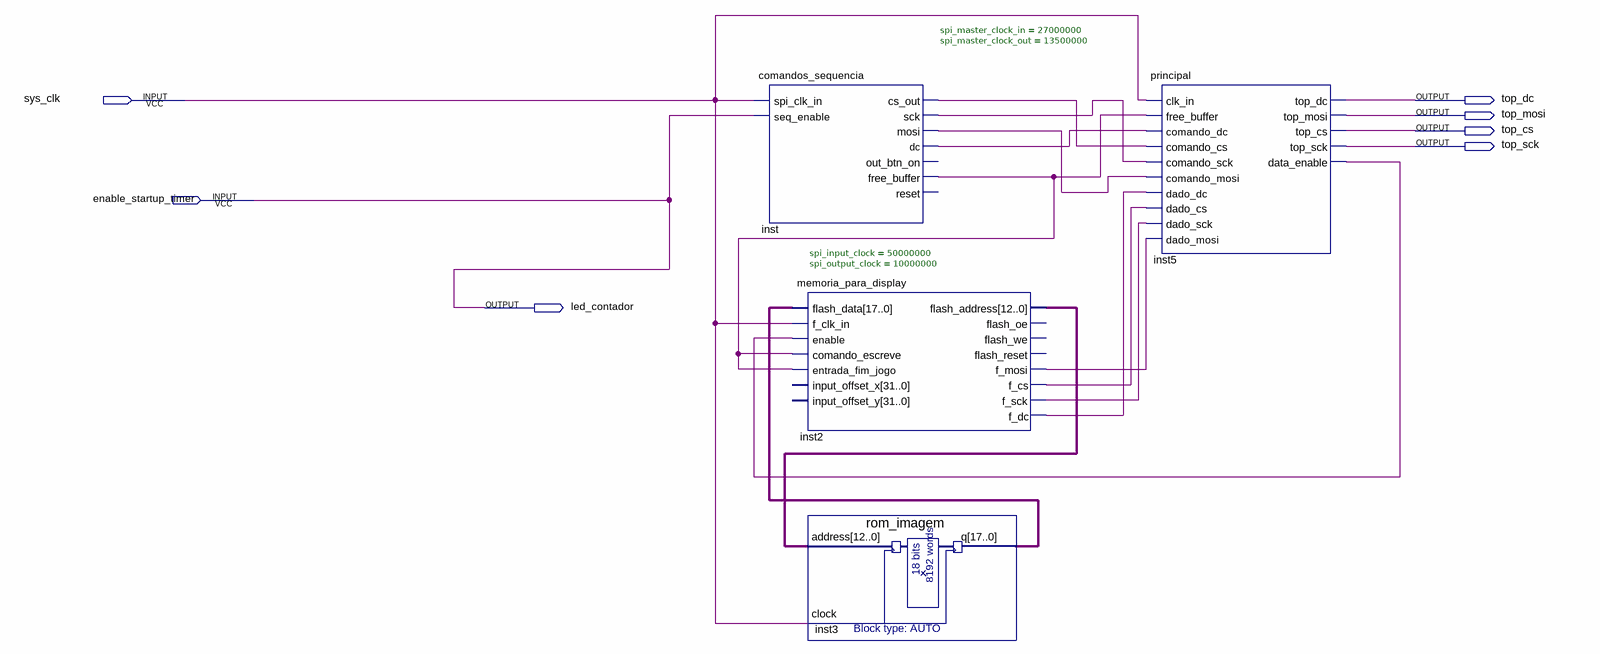
[diagram p0: schematic sheet]
// Quartus schematic top.bdf as structural Verilog: 4 symbols, 7 pins
module top (
  input  sys_clk,
  input  enable_startup_timer,
  output top_dc,
  output top_mosi,
  output top_cs,
  output top_sck,
  output led_contador
);

  wire inst2_f_cs, inst2_f_dc, inst2_f_mosi, inst2_f_sck, inst5_data_enable, inst_cs_out, inst_dc,
       inst_free_buffer, inst_mosi, inst_sck;
  wire [12:0] inst2_flash_address;
  wire [17:0] inst3_q;

  comandos_sequencia #(.spi_master_clock_in(27000000), .spi_master_clock_out(13500000)) inst (
    .spi_clk_in(sys_clk), .seq_enable(enable_startup_timer), .cs_out(inst_cs_out), .sck(inst_sck),
    .mosi(inst_mosi), .dc(inst_dc), .free_buffer(inst_free_buffer));  // open: out_btn_on, reset
  memoria_para_display #(.spi_input_clock(50000000), .spi_output_clock(10000000)) inst2 (
    .flash_data(inst3_q), .f_clk_in(sys_clk), .enable(inst5_data_enable), .comando_escreve(inst_free_buffer),
    .entrada_fim_jogo(inst_free_buffer), .flash_address(inst2_flash_address), .f_mosi(inst2_f_mosi),
    .f_cs(inst2_f_cs), .f_sck(inst2_f_sck), .f_dc(inst2_f_dc));  // open: input_offset_x, input_offset_y, flash_oe, flash_we, flash_reset
  rom_imagem inst3 (.address(inst2_flash_address), .clock(sys_clk), .q(inst3_q));
  principal inst5 (
    .clk_in(sys_clk), .free_buffer(inst_free_buffer), .comando_dc(inst_dc), .comando_cs(inst_cs_out),
    .comando_sck(inst_sck), .comando_mosi(inst_mosi), .dado_dc(inst2_f_dc), .dado_cs(inst2_f_cs),
    .dado_sck(inst2_f_sck), .dado_mosi(inst2_f_mosi), .top_dc(top_dc), .top_mosi(top_mosi), .top_cs(top_cs),
    .top_sck(top_sck), .data_enable(inst5_data_enable));

  assign led_contador = enable_startup_timer;
endmodule
